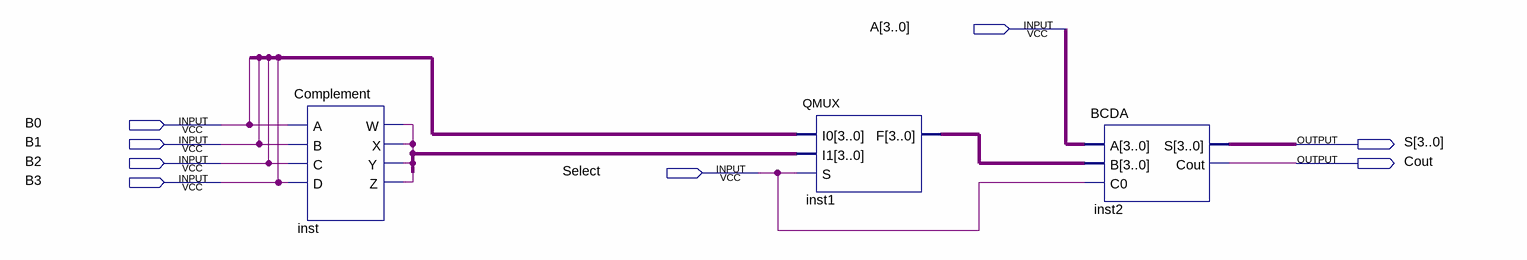
[diagram p0: schematic sheet]
// Quartus schematic BLOCK.bdf as structural Verilog: 3 symbols, 8 pins
module BLOCK (
  input  [3:0] A,
  input  B0,
  input  B1,
  input  B2,
  input  Select,
  input  B3,
  output [3:0] S,
  output Cout
);

  wire inst_w, inst_y, inst_z;
  wire [3:0] inst1_f, undriven, undriven_2;

  Complement inst (.A(B0), .B(B1), .C(B2), .D(B3), .W(inst_w), .X(inst_w), .Y(inst_y), .Z(inst_z));
  QMUX inst1 (.I0(undriven_2), .I1(undriven), .S(Select), .F(inst1_f));
  BCDA inst2 (.A(A), .B(inst1_f), .C0(Select), .S(S), .Cout(Cout));
endmodule
